# Altium schematic sheet PultTelega.SchDoc
size A4
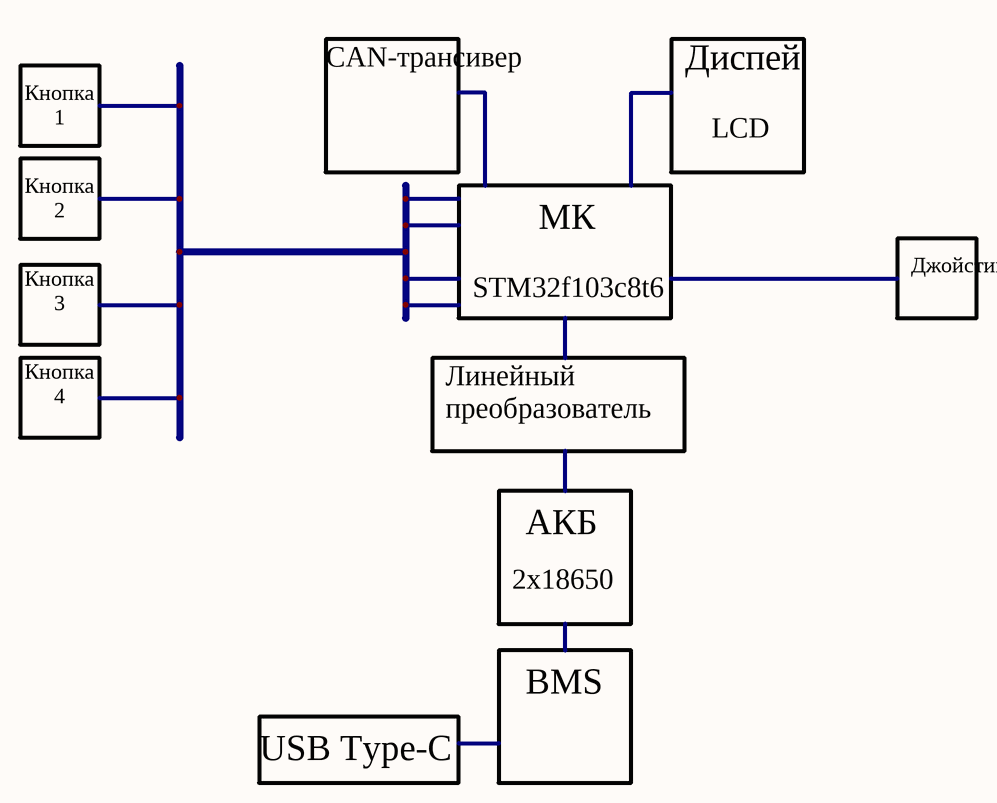
[diagram p0: PultTelega.SchDoc]

## Notes on the sheet
- CAN-трансивер
- Диспей
- Кнопка 1
- LCD
- Кнопка 2
- МК
- Кнопка 3
- STM32f103c8t6
- Джойстик
- Кнопка 4
- Линейный преобразователь
- АКБ
- 2x18650
- BMS
- USB Type-C